# Altium schematic sheet DISEÑO CON 3.3 Y 5 spi separado y diodos.SchDoc
size A3; Organization: Altium Limited; Address1: L3, 12a Rodborough Rd; Address2: Frenchs Forest; Address3: NSW; Address4: Australia 2086
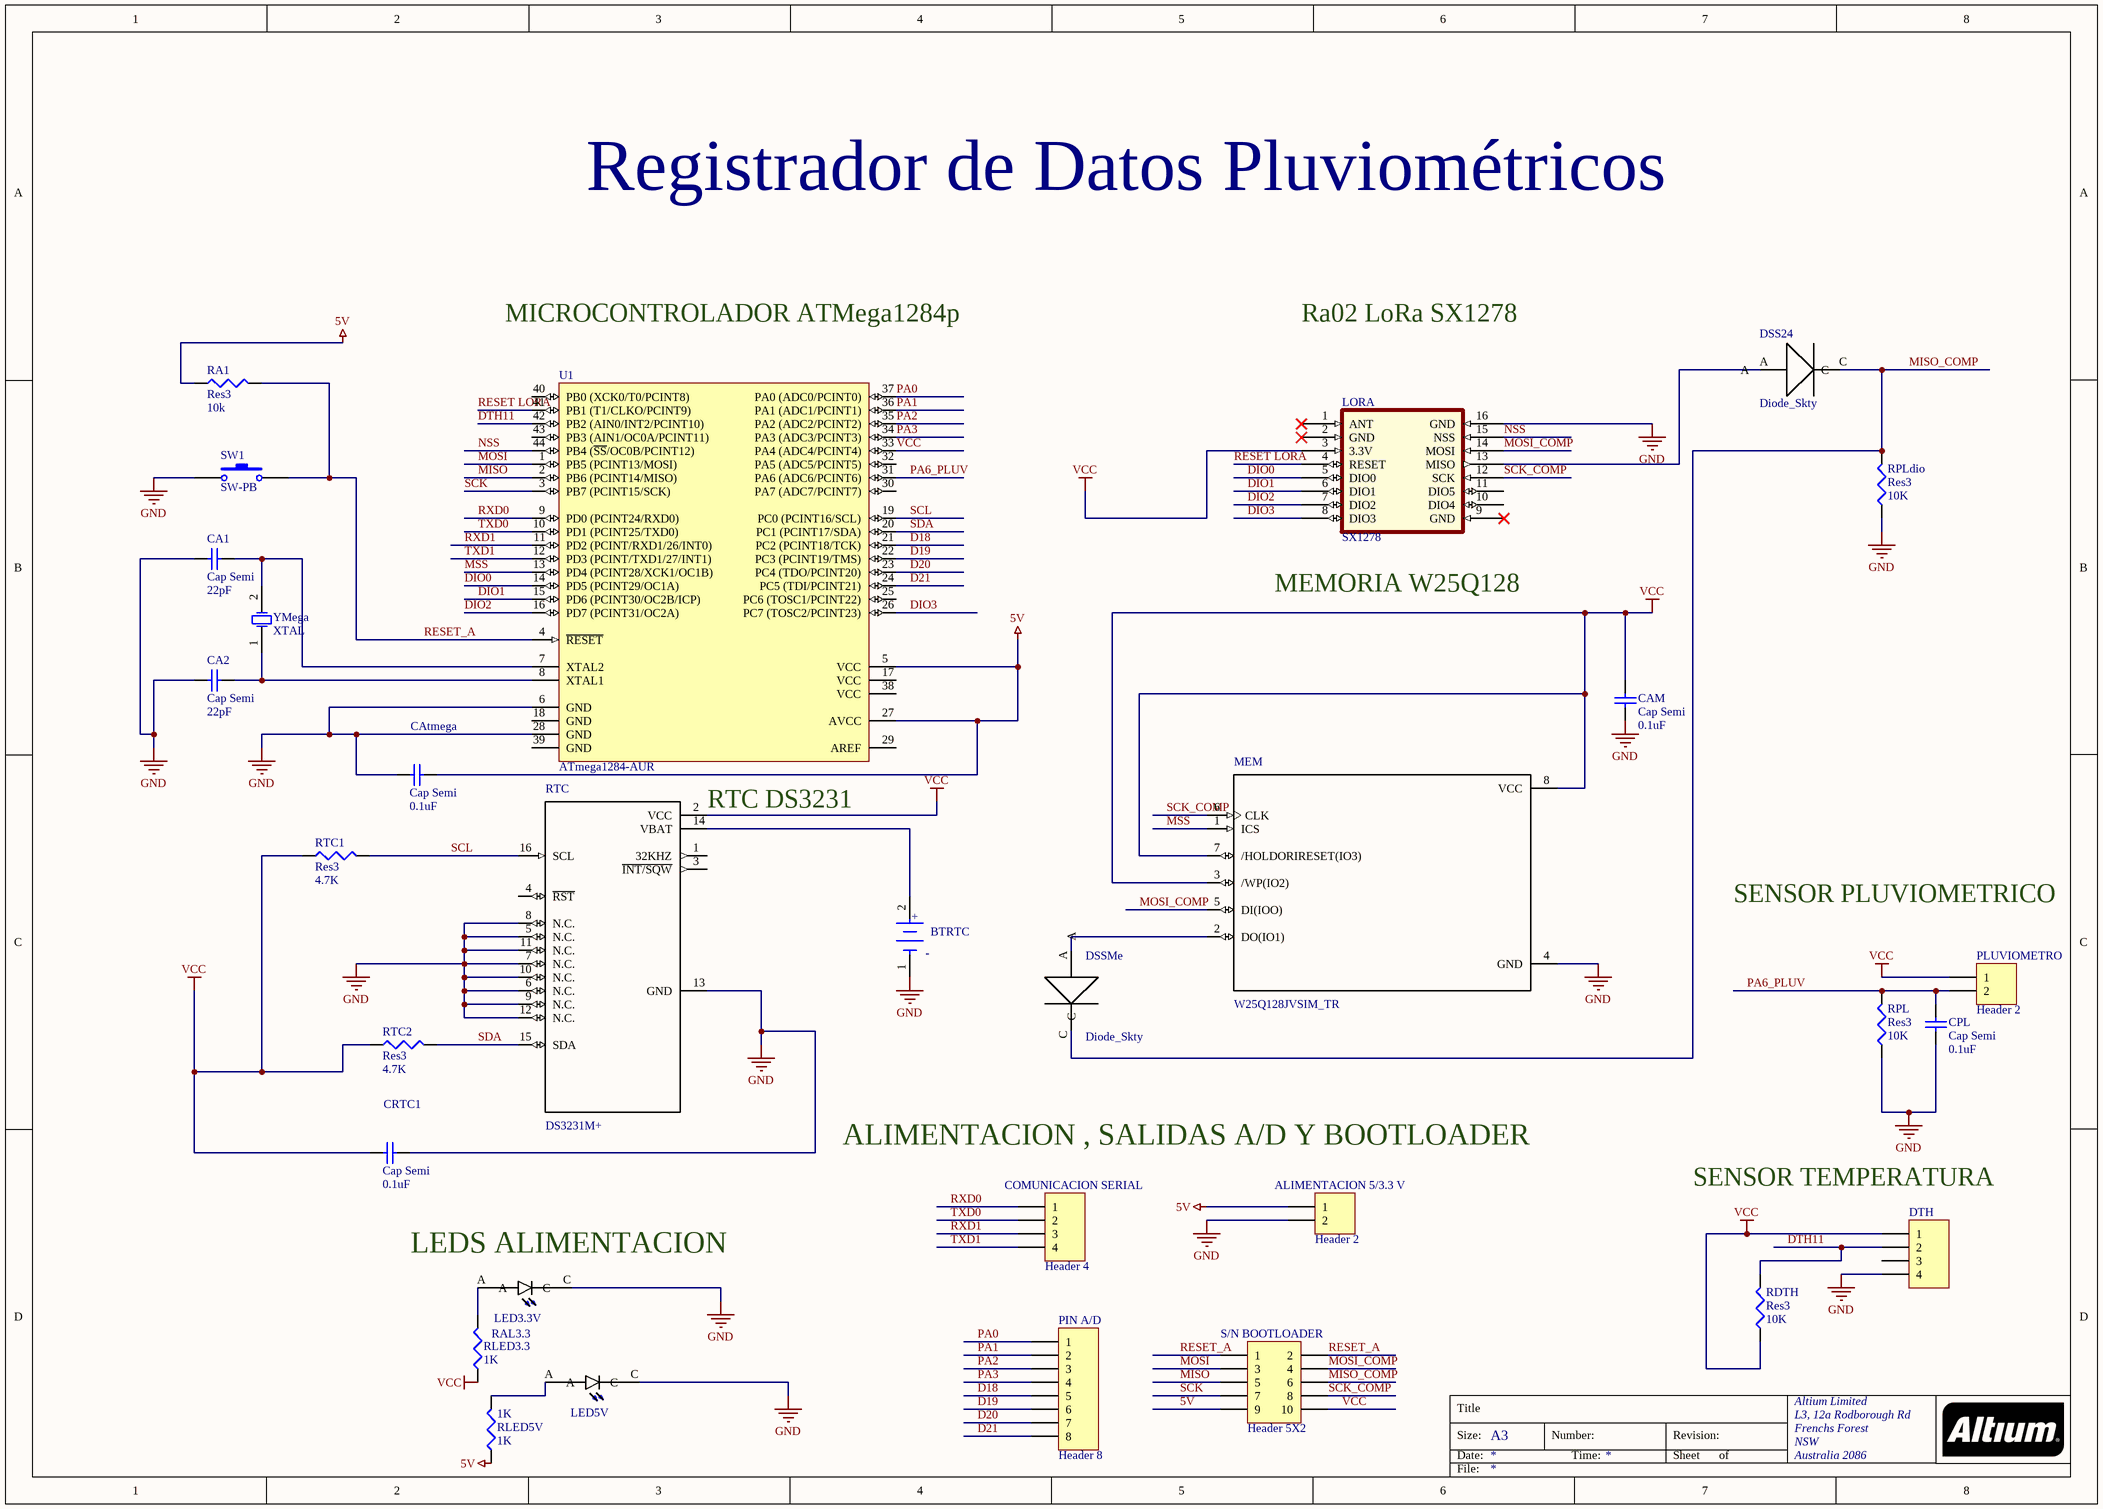
[diagram p0: DISEÑO CON 3.3 Y 5 spi separado y diodos.SchDoc]

## Parts
1K  RLED5V  value 1K  [6-0805_L]
ALIMENTACION_5/3.3_V  Header 2  [HDR1X2]
BTRTC  CR-1220-HFN  [Panasonic_CR-1220-HFN_MFG]  (value not drawn)
CA1  Cap Semi  value 22pF  [C0805]
CA2  Cap Semi  value 22pF  [C0805]
CAM  Cap Semi  value 0.1uF  [C0805]
CAtmega  Cap Semi  value 0.1uF  [C0805]
COMUNICACION_SERIAL  Header 4  [HDR1X4]
CPL  Cap Semi  value 0.1uF  [C0805]
CRTC1  Cap Semi  value 0.1uF  [C0805]
DSS24  Diode_Skty  [*DIOM5436X247N]
DSSMe  Diode_Skty  [*DIOM5436X247N]
DTH  (no value)  [HDR1X4]
LED3.3V  (no value)  [*LEDC2012X70N_598-8140-107F(Primary)]
LED5V  (no value)  [*LEDC2012X70N_598-8140-107F(Primary)]
LORA  SX1278  [SOP200P1800X250-16N]
MEM  W25Q128JVSIM_TR  [*SOIC127P790X216-8N]
PIN_A/D  Header 8  [HDR1X8]
PLUVIOMETRO  Header 2  [HDR1X2]
RA1  Res3  value 10k  [6-0805_L]
RAL3.3  RLED3.3  value 1K  [6-0805_L]
RDTH  Res3  value 10K  [6-0805_L]
RPL  Res3  value 10K  [6-0805_L]
RPLdio  Res3  value 10K  [6-0805_L]
RTC  DS3231M+  [*SOIC127P1032X265-16N]
RTC1  Res3  value 4.7K  [6-0805_L]
RTC2  Res3  value 4.7K  [6-0805_L]
S/N_BOOTLOADER  Header 5X2  [HDR2X5]
SW1  SW-PB  [SPST-2]
U1  ATmega1284-AUR  [44A_N]
YMega  XTAL  [R38]

## Nets
5V: 1K.1 ALIMENTACION_5/3.3_V.1 CAtmega.2 RA1.1 S/N_BOOTLOADER.9 U1.5(VCC) U1.27(AVCC)
GND: ALIMENTACION_5/3.3_V.2 BTRTC.1(C) CA1.1 CA2.1 CAM.1 CAtmega.1 CPL.1 CRTC1.2 DTH.4 LED3.3V.C LED5V.C LORA.16(GND) MEM.4(GND) RPL.1 RPLdio.1 RTC.5(N.C.) RTC.6(N.C.) RTC.7(N.C.) RTC.8(N.C.) RTC.9(N.C.) RTC.10(N.C.) RTC.11(N.C.) RTC.12(N.C.) RTC.13(GND) SW1.1 U1.6(GND) U1.28(GND)
VCC: CAM.2 CRTC1.1 DTH.1 LORA.3(3.3V) MEM.3(/WP(IO2)) MEM.7(/HOLDORIRESET(IO3)) MEM.8(VCC) PLUVIOMETRO.1 RAL3.3.1 RDTH.1 RTC.2(VCC) RTC1.1 RTC2.1 S/N_BOOTLOADER.10 U1.33(PA4_(ADC4/PCINT4))
D18: PIN_A/D.5 U1.21(PC2_(PCINT18/TCK))
D19: PIN_A/D.6 U1.22(PC3_(PCINT19/TMS))
D20: PIN_A/D.7 U1.23(PC4_(TDO/PCINT20))
D21: PIN_A/D.8 U1.24(PC5_(TDI/PCINT21))
DIO0: LORA.5(DIO0) U1.14(PD5_(PCINT29/OC1A))
DIO1: LORA.6(DIO1) U1.15(PD6_(PCINT30/OC2B/ICP))
DIO2: LORA.7(DIO2) U1.16(PD7_(PCINT31/OC2A))
DIO3: LORA.8(DIO3) U1.26(PC7_(TOSC2/PCINT23))
DTH11: DTH.2 RDTH.2 U1.42(PB2_(AIN0/INT2/PCINT10))
MISO: S/N_BOOTLOADER.5 U1.2(PB6_(PCINT14/MISO))
MISO_COMP: DSS24.C DSSMe.C RPLdio.2 S/N_BOOTLOADER.6
MOSI: S/N_BOOTLOADER.3 U1.1(PB5_(PCINT13/MOSI))
MOSI_COMP: LORA.14(MOSI) MEM.5(DI(IOO)) S/N_BOOTLOADER.4
MSS: MEM.1(ICS) U1.13(PD4_(PCINT28/XCK1/OC1B))
NSS: LORA.15(NSS) U1.44(PB4_(~{SS}/OC0B/PCINT12))
PA0: PIN_A/D.1 U1.37(PA0_(ADC0/PCINT0))
PA1: PIN_A/D.2 U1.36(PA1_(ADC1/PCINT1))
PA2: PIN_A/D.3 U1.35(PA2_(ADC2/PCINT2))
PA3: PIN_A/D.4 U1.34(PA3_(ADC3/PCINT3))
PA6_PLUV: CPL.2 PLUVIOMETRO.2 RPL.2 U1.31(PA6_(ADC6/PCINT6))
RESET LORA: LORA.4(RESET) U1.41(PB1_(T1/CLKO/PCINT9))
RESET_A: RA1.2 S/N_BOOTLOADER.1 S/N_BOOTLOADER.2 SW1.2 U1.4(~{RESET})
RXD0: COMUNICACION_SERIAL.1 U1.9(PD0_(PCINT24/RXD0))
RXD1: COMUNICACION_SERIAL.3 U1.11(PD2_(PCINT/RXD1/26/INT0))
SCK: S/N_BOOTLOADER.7 U1.3(PB7_(PCINT15/SCK))
SCK_COMP: LORA.12(SCK) MEM.6(CLK) S/N_BOOTLOADER.8
SCL: RTC.16(SCL) RTC1.2 U1.19(PC0_(PCINT16/SCL))
SDA: RTC.15(SDA) RTC2.2 U1.20(PC1_(PCINT17/SDA))
TXD0: COMUNICACION_SERIAL.2 U1.10(PD1_(PCINT25/TXD0))
TXD1: COMUNICACION_SERIAL.4 U1.12(PD3_(PCINT/TXD1/27/INT1))
Net1K_2: 1K.2 LED5V.A
NetBTRTC_2: BTRTC.2(A) RTC.14(VBAT)
NetCA1_2: CA1.2 U1.7(XTAL2) YMega.2(OSC2)
NetCA2_2: CA2.2 U1.8(XTAL1) YMega.1(OSC1)
NetDSS24_A: DSS24.A LORA.13(MISO)
NetDSSMe_A: DSSMe.A MEM.2(DO(IO1))
NetLED3.3V_A: LED3.3V.A RAL3.3.2

Not connected (* = marked no-connect by the designer): DTH 3; LORA 1(ANT)* 2(GND)* 9(GND)* 10(DIO4) 11(DIO5); RTC 1(32KHZ) 3(~{INT/SQW}) 4(~{RST}); U1 17(VCC) 18(GND) 25(PC6_(TOSC1/PCINT22)) 29(AREF) 30(PA7_(ADC7/PCINT7)) 32(PA5_(ADC5/PCINT5)) 38(VCC) 39(GND) 40(PB0_(XCK0/T0/PCINT8)) 43(PB3_(AIN1/OC0A/PCINT11))

## Notes on the sheet
- Registrador de Datos Pluviométricos
- MICROCONTROLADOR ATMega1284p
- Ra02 LoRa SX1278
- (near LORA) MEMORIA W25Q128
- RTC DS3231
- SENSOR PLUVIOMETRICO
- ALIMENTACION , SALIDAS A/D Y BOOTLOADER
- (near DTH) SENSOR TEMPERATURA
- (near LED3.3V) LEDS ALIMENTACION
- Title
- Size:
- Date:
- A3
- Number:
- Time:
- Revision:
- Sheet
- of
- File:
- (in symbol CR-1220-HFN) +; -

## Library data of the parts
1K RA1 RAL3.3 RDTH RPL RPLdio RTC1 RTC2 = Res3: Resistor; Published: 8-Jun-2000; LatestRevisionDate: 29-May-2009; LatestRevisionNote: IPC-7351 Footprint Added.; PackageReference: J1-0603; Publisher: Altium Limited; PackageDescription: Chip Resistor
ALIMENTACION_5/3.3_V PLUVIOMETRO = Header 2: Header, 2-Pin; LatestRevisionDate: 17-Jul-2002; LatestRevisionNote: Re-released for DXP Platform.; Publisher: Altium Limited
CA1 CA2 CAM CAtmega CPL CRTC1 = Cap Semi: Capacitor (Semiconductor SIM Model); Published: 8-Jun-2000; LatestRevisionDate: 29-May-2009; LatestRevisionNote: IPC-7351 Footprint Added.; PackageReference: C1206; Publisher: Altium Limited; PackageDescription: Chip Capacitor
COMUNICACION_SERIAL DTH = Header 4: Header, 4-Pin; LatestRevisionDate: 17-Jul-2002; LatestRevisionNote: Re-released for DXP Platform.; Publisher: Altium Limited
DSS24 DSSMe LORA = Component_1
LED3.3V LED5V = 598-8140-107F: Led; 0805 Smt Led, Yellow, Alingap, Water Clear Lens, 140 Deg Viewing Angle; MF: Dialight; Availability: Unavailable; SnapEDA_Link: https://www.snapeda.com/parts/598-8140-107F/Dialight/view-part/?ref=snap; Price: None; Package: 0805 Dialight; MP: 598-8140-107F; Value: *
MEM = W25Q128JVSIM_TR: Ic Flash 128mbit 133mhz 8soic; MP: W25Q128JVSIM TR; MF: Winbond Electronics; SnapEDA_Link: https://www.snapeda.com/parts/W25Q128JVSIM%20TR/Winbond%20Electronics/view-part/?ref=snap; Package: SOIC-8 Winbond; Price: None; Availability: Unavailable; Value: *
PIN_A/D = Header 8: Header, 8-Pin; LatestRevisionDate: 17-Jul-2002; LatestRevisionNote: Re-released for DXP Platform.; Publisher: Altium Limited
RTC = DS3231M+: Ic Real Time Clock I2c 16soic - Ds3231m+; MF: Maxim Integrated; Price: None; Availability: Unavailable; MP: DS3231M+; Package: SOIC-16 Maxim; SnapEDA_Link: https://www.snapeda.com/parts/DS3231M%2B/Maxim%20Integrated/view-part/?ref=snap; Value: *
S/N_BOOTLOADER = Header 5X2: Header, 5-Pin, Dual row; LatestRevisionDate: 17-Jul-2002; LatestRevisionNote: Re-released for DXP Platform.; Publisher: Altium Limited
SW1 = SW-PB: Switch; Published: 24-Mar-1999; LatestRevisionDate: 17-Jul-2002; LatestRevisionNote: Re-released for DXP Platform.; PackageReference: SPST-2; Publisher: Altium Limited; PackageDescription: Switch; 2 Leads
U1 = ATmega1284-AUR: 8-bit AVR Microcontroller, 128KB Flash, 4KB EEPROM, 16KB SRAM, 44-pin TQFP, Industrial Grade (-40°C to 85°C), Reel; Published: 1-Apr-2010; DatasheetVersion: revA, Jan-2010; PackageVersion: rev.B, Oct-2001; PackageReference: 44A; Publisher: Altium Limited; PackageDescription: 44-Pin Plastic Thin Profile Quad Flat Pack, 10 x 10 x 1.0 mm Body, 0.8 mm Pitch (TQFP); Supplier 1: Digi-Key; Supplier Part Number 1: ATMEGA1284-AUR-ND; Supplier 2: Mouser; Supplier Part Number 2: 556-ATMEGA1284-AUR; ComponentLink1Description: Manufacturer Link; ComponentLink1URL: http://www.atmel.com/products/avr/default.asp?; ComponentLink2Description: ATmega164A/164PA/324A/324PA/644A/644PA/1284/1284P Datasheet; ComponentLink2URL: http://www.atmel.com/dyn/resources/prod_documents/doc8272.pdf; ComponentLink3Description: ATmega164A/164PA/324A/324PA/644A/644PA/1284/1284P Summary; ComponentLink3URL: http://www.atmel.com/dyn/resources/prod_documents/8272S.pdf; ComponentLink4Description: Atmel.com Home; ComponentLink4URL: http://www.atmel.com
YMega = XTAL: Crystal Oscillator; Published: 8-Jun-2000; LatestRevisionDate: 17-Jul-2002; LatestRevisionNote: Re-released for DXP Platform.; PackageReference: R38; Publisher: Altium Limited; PackageDescription: Crystal, Thru-Hole; 2 Leads; Body 3.1 x 8.2 mm (Dia.xH)